# EAGLE design SolarPanel (EAGLE 5.11)
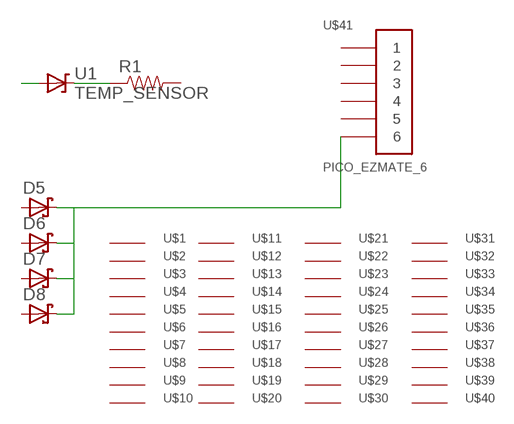
[diagram p0: schematic, sheet 1]

## Parts
D5  SB_DIODE  [SB_DIODE]
D6  SB_DIODE  [SB_DIODE]
D7  SB_DIODE  [SB_DIODE]
D8  SB_DIODE  [SB_DIODE]
R1  RESISTOR  [0805]
U1  TEMP_SENSOR  [SO8]
U$1  PADMI  [PADMI]
U$2  PADMI  [PADMI]
U$3  PADMI  [PADMI]
U$4  PADMI  [PADMI]
U$5  PADMI  [PADMI]
U$6  PADMI  [PADMI]
U$7  PADMI  [PADMI]
U$8  PADMI  [PADMI]
U$9  PADMI  [PADMI]
U$10  PADMI  [PADMI]
U$11  PADMI  [PADMI]
U$12  PADMI  [PADMI]
U$13  PADMI  [PADMI]
U$14  PADMI  [PADMI]
U$15  PADMI  [PADMI]
U$16  PADMI  [PADMI]
U$17  PADMI  [PADMI]
U$18  PADMI  [PADMI]
U$19  PADMI  [PADMI]
U$20  PADMI  [PADMI]
U$21  PADMI  [PADMI]
U$22  PADMI  [PADMI]
U$23  PADMI  [PADMI]
U$24  PADMI  [PADMI]
U$25  PADMI  [PADMI]
U$26  PADMI  [PADMI]
U$27  PADMI  [PADMI]
U$28  PADMI  [PADMI]
U$29  PADMI  [PADMI]
U$30  PADMI  [PADMI]
U$31  PADMI  [PADMI]
U$32  PADMI  [PADMI]
U$33  PADMI  [PADMI]
U$34  PADMI  [PADMI]
U$35  PADMI  [PADMI]
U$36  PADMI  [PADMI]
U$37  PADMI  [PADMI]
U$38  PADMI  [PADMI]
U$39  PADMI  [PADMI]
U$40  PADMI  [PADMI]
U$41  PICO_EZMATE_6  [PICO_EZMATE_6]

## Nets
N$44: D5.NEG D6.NEG D7.NEG D8.NEG U$41.6
N$59: U1.4(V-)
N$60: R1.1 U1.8(V+)
Unconnected: D5.POS D6.POS D7.POS D8.POS R1.2 U$1.P$1 U$2.P$1 U$3.P$1 U$4.P$1 U$5.P$1 U$6.P$1 U$7.P$1 U$8.P$1 U$9.P$1 U$10.P$1 U$11.P$1 U$12.P$1 U$13.P$1 U$14.P$1 U$15.P$1 U$16.P$1 U$17.P$1 U$18.P$1 U$19.P$1 U$20.P$1 U$21.P$1 U$22.P$1 U$23.P$1 U$24.P$1 U$25.P$1 U$26.P$1 U$27.P$1 U$28.P$1 U$29.P$1 U$30.P$1 U$31.P$1 U$32.P$1 U$33.P$1 U$34.P$1 U$35.P$1 U$36.P$1 U$37.P$1 U$38.P$1 U$39.P$1 U$40.P$1 U$41.1 U$41.2 U$41.3 U$41.4 U$41.5

## Library data of the parts
D5-D8 = phonesat:SB_DIODE
R1 = phonesat:RESISTOR: Resistor Basic schematic elements and footprints for 0603, 1206, and PTH 1/10th watt (small) resistors.
U1 = phonesat:TEMP_SENSOR
U$1-U$40 = phonesat:PADMI
U$41 = phonesat:PICO_EZMATE_6

## Board
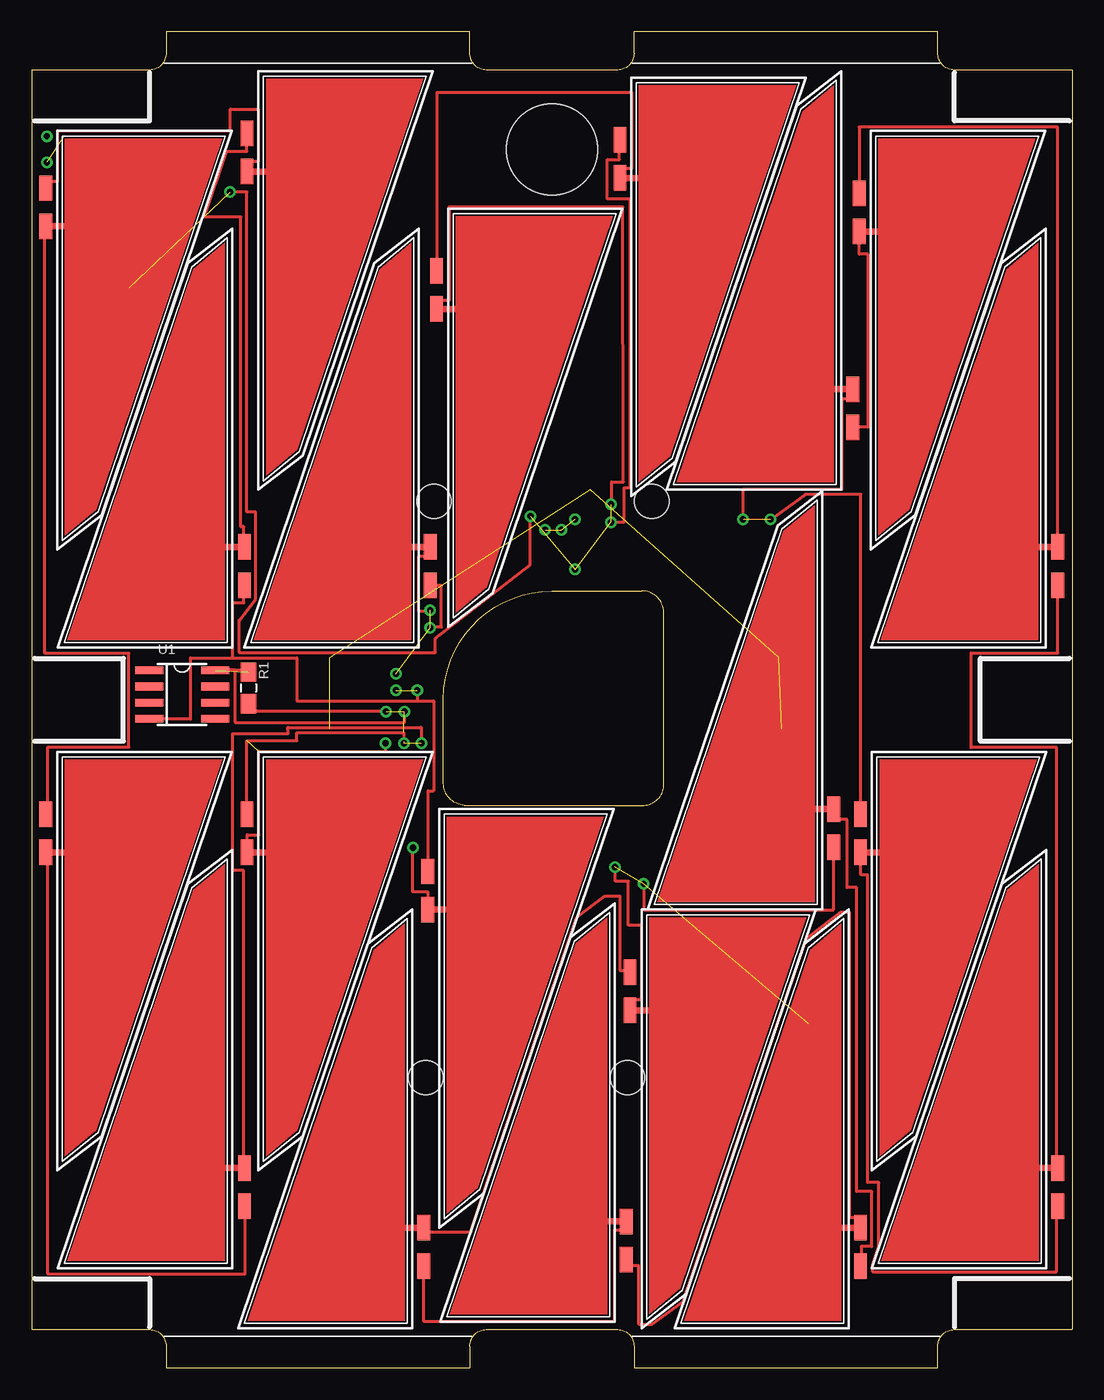
[diagram p1: board, top side]
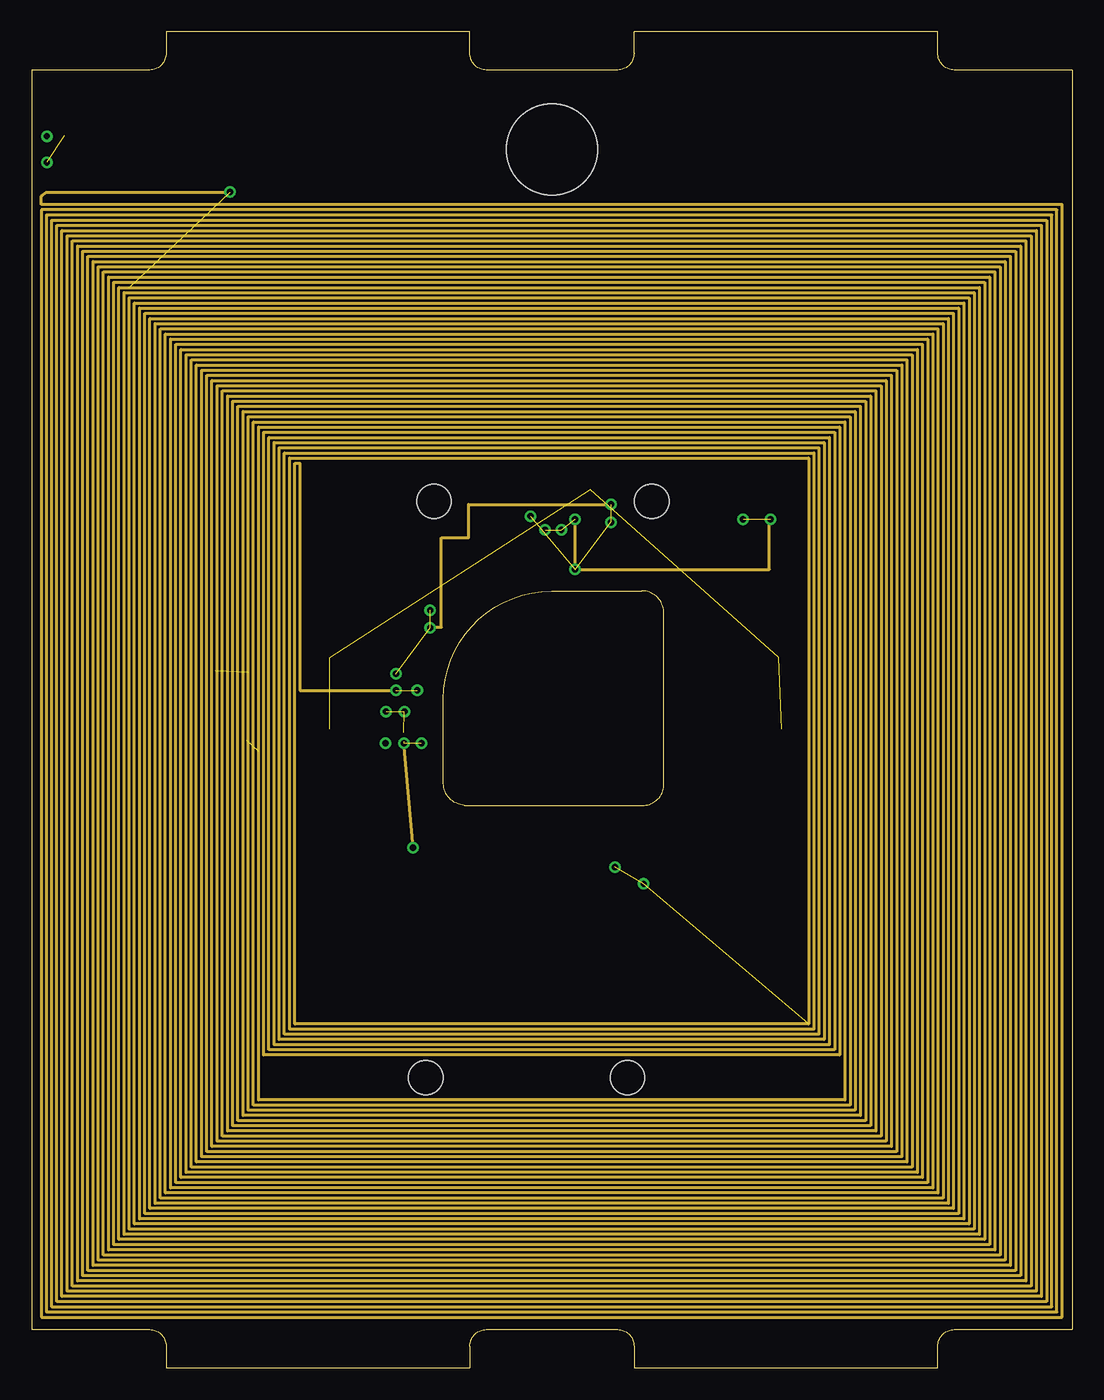
[diagram p2: board, inner layer Route2]
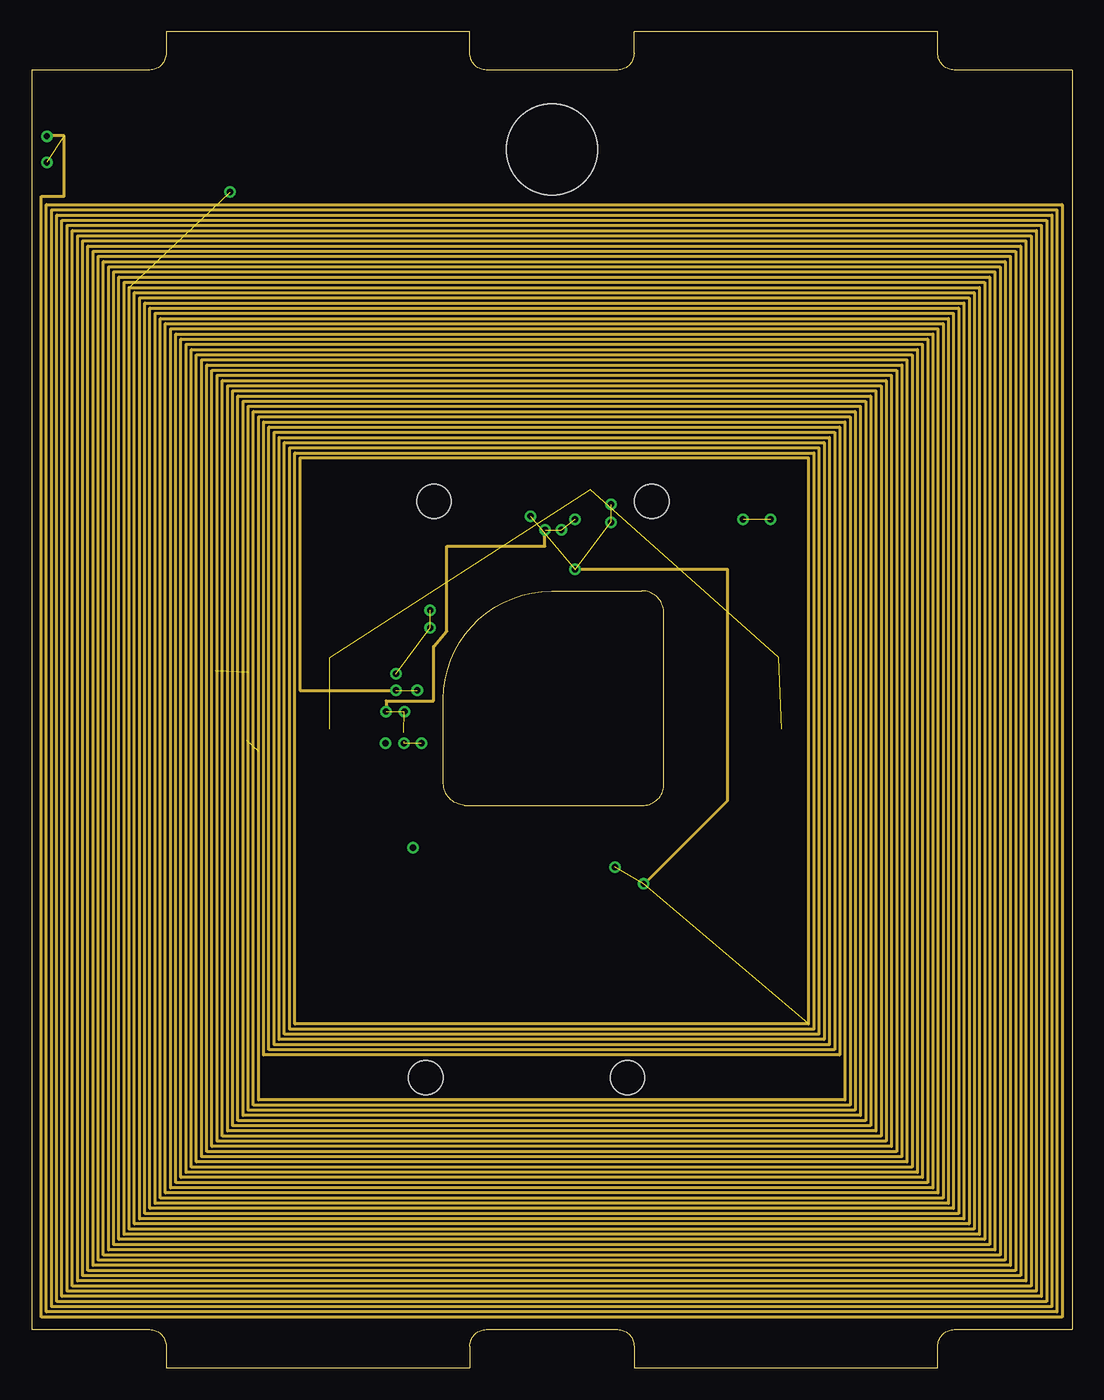
[diagram p3: board, inner layer Route3]
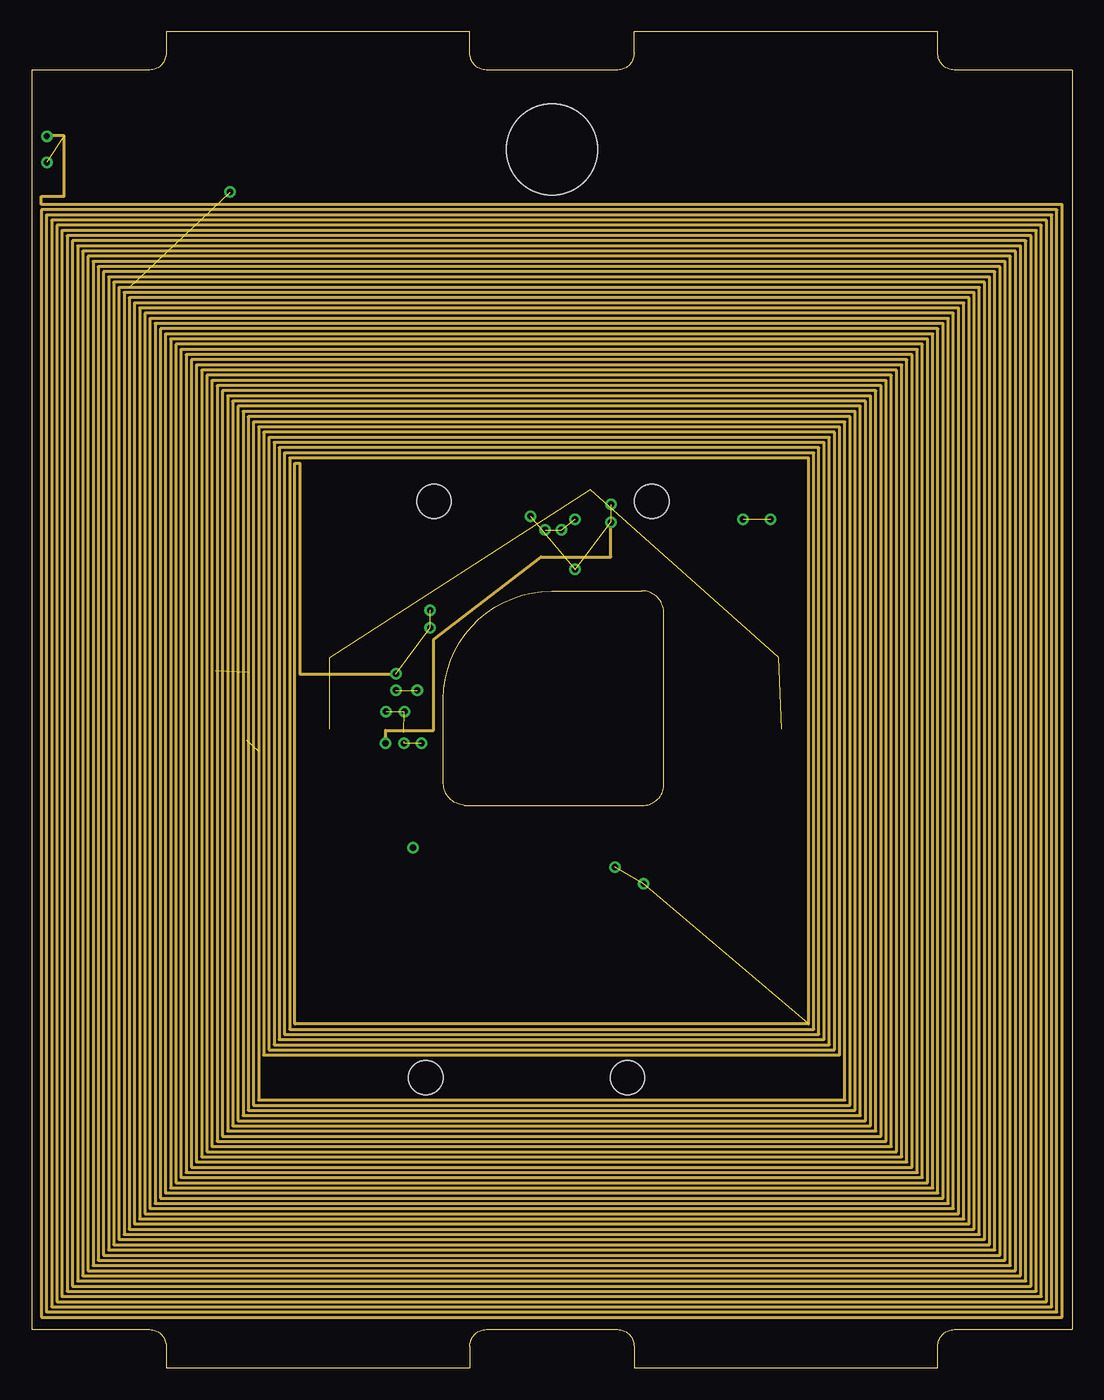
[diagram p4: board, inner layer Route14]
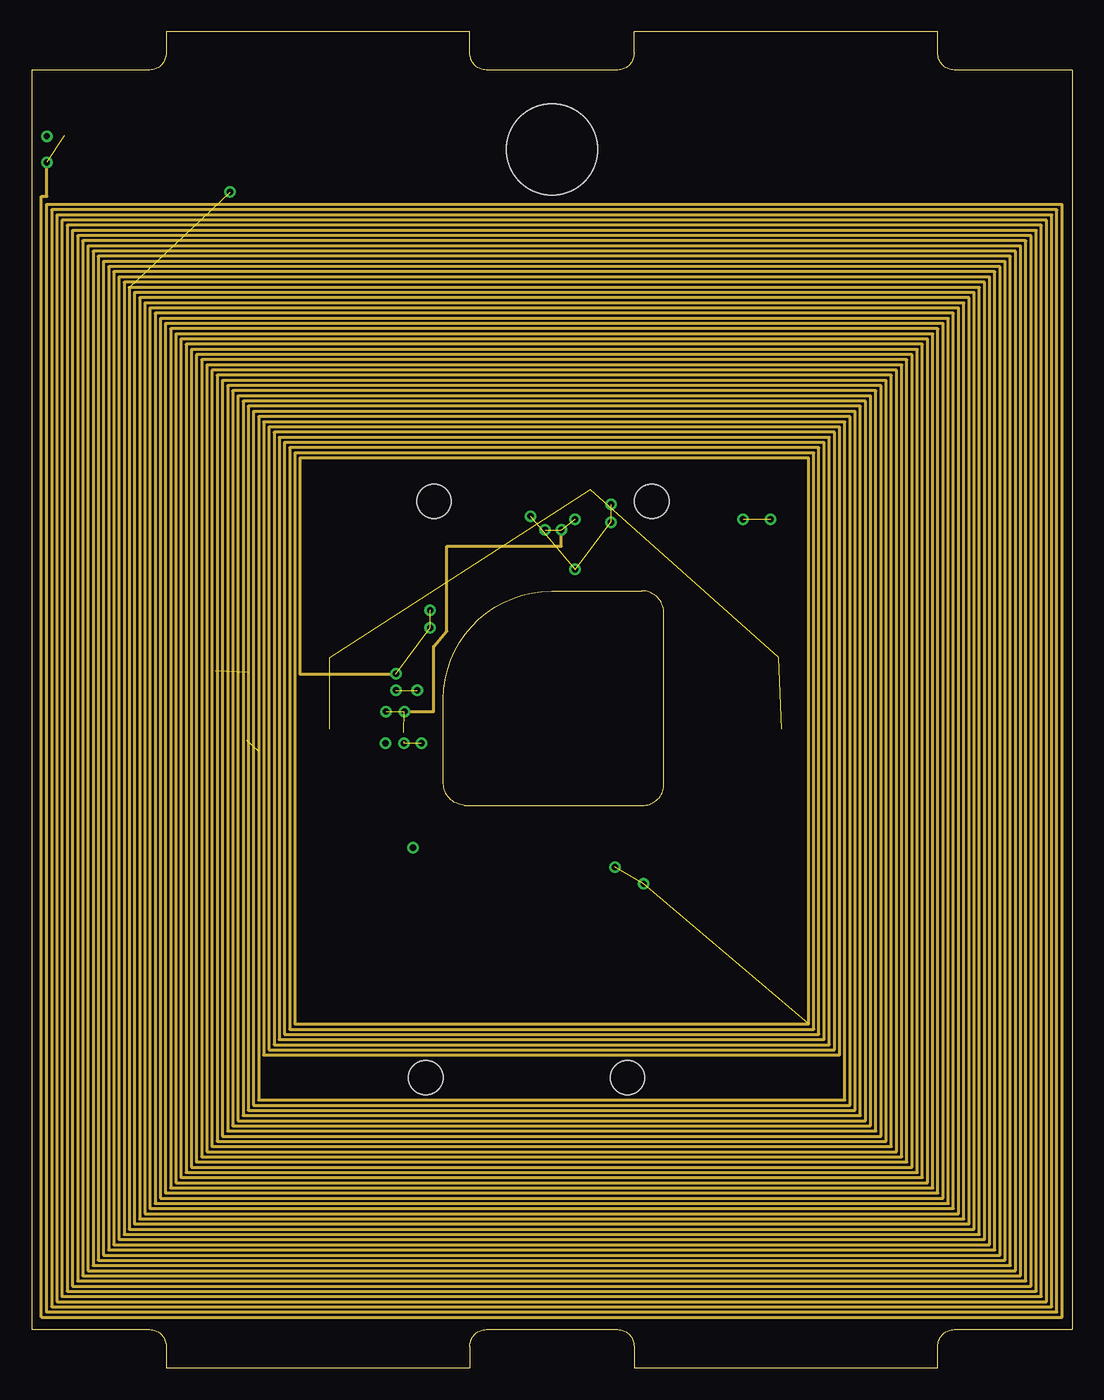
[diagram p5: board, inner layer Route15]
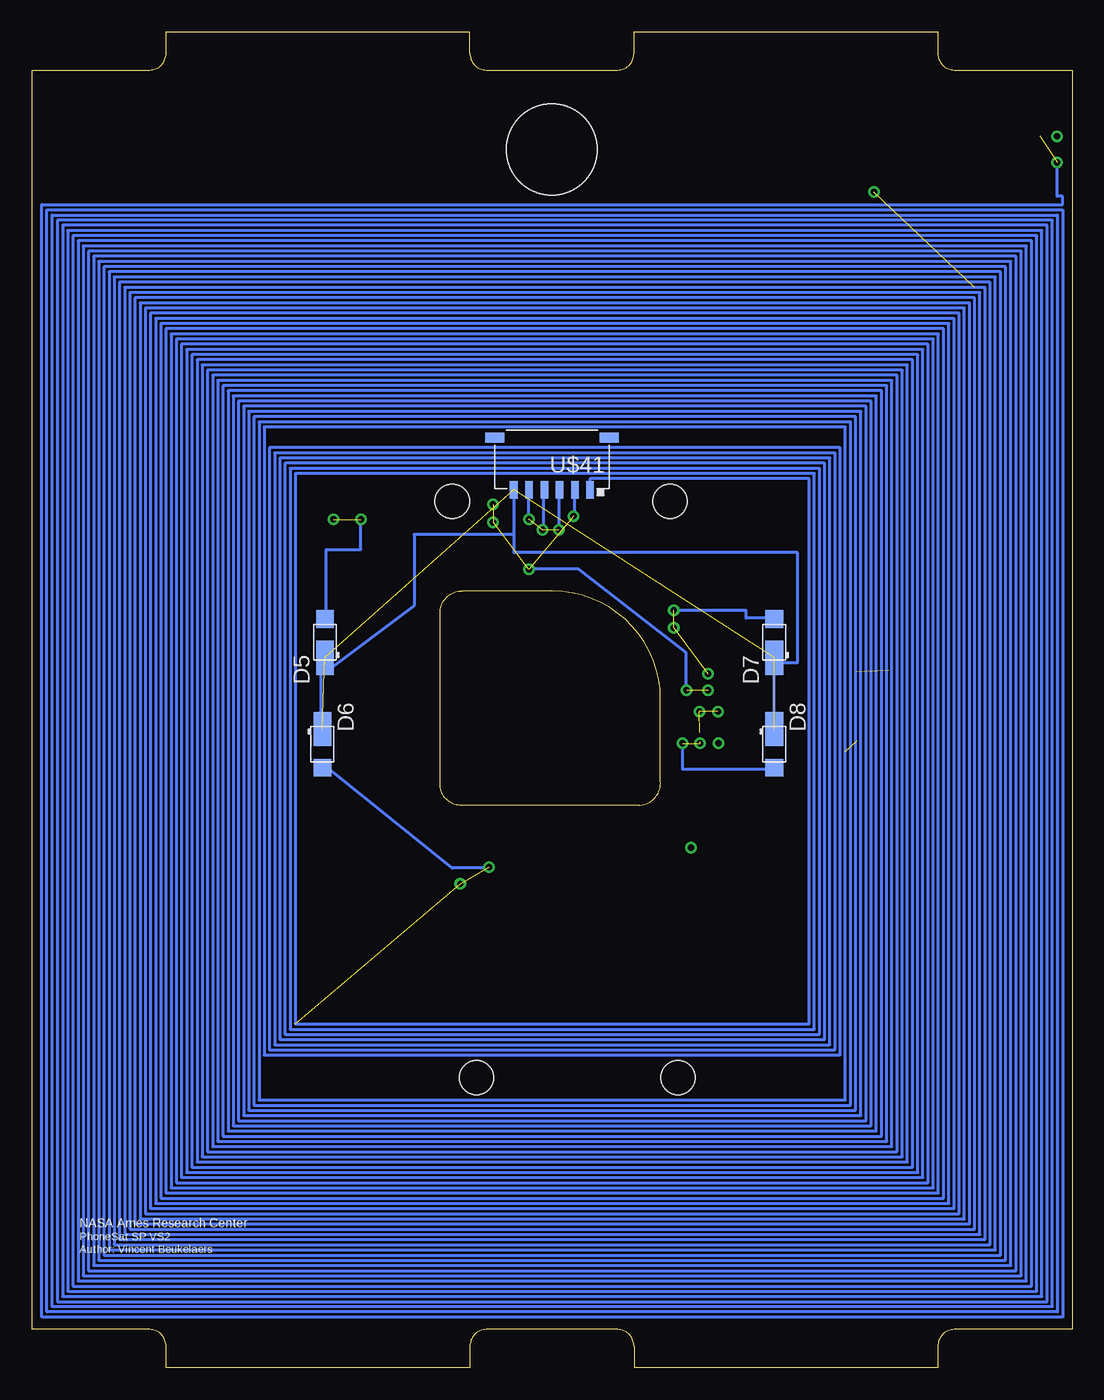
[diagram p6: board, bottom side, seen from below]

Size 81.73 x 104.99 mm. Coordinates in mm from the lower left corner, seen from the top.
Outline: 81.73,101.99 81.73,3 72.48,3 arc90 71.18,1.7 71.18,0 47.31,0 47.31,1.7 arc90 46.02,3 35.72,3 arc90 34.41,1.7 34.41,0 10.55,0 10.55,1.7 arc90 9.25,3 0,3 0,101.99 9.25,101.99 arc90 10.55,103.29 10.55,104.99 34.41,104.99 34.41,103.29 arc90 35.72,101.99 46.02,101.99 arc90 47.31,103.29 47.31,104.99 71.18,104.99 71.18,103.29 arc90 72.48,101.99 81.73,101.99
Outline: 32.34,52.54 arc-90 40.84,61.04 47.91,61.04 arc-90 49.64,59.42 49.65,45.91 arc-90 48.1,44.2 33.96,44.2 arc-90 32.34,46.08 32.34,52.54
Copper layers (1*2*3*14*15*16): Top 0.035mm / dielectric 0.15mm / Route2 0.035mm / dielectric 0.15mm / Route3 0.035mm / dielectric 0.2mm / Route14 0.035mm / dielectric 0.15mm / Route15 0.035mm / dielectric 0.2mm / Bottom 0.035mm
Design rules "default *": minimum track width 10mil, minimum drill 24mil, track to track 8mil, track to pad 8mil, pad to pad 8mil, via to via 8mil, smd to smd 8mil, copper to edge 40mil, drill to drill 8mil, minimum pad ring 10mil, minimum via ring 8mil, stop-mask expansion 4mil, vias tented up to drill 0mil, thermal gap 10mil
Holes 7.14 mm at 40.87,95.74
Holes 2.7 mm at 31.6,68.1 48.7,68.1 46.8,22.8 30.95,22.8

### Footprints (pad centres in the part's own frame; a part is rotated, then mirrored left to right if it is on the bottom)
SB_DIODE = smd 2.7 x 1.4: NEG -1.2,0 | smd 1.4 x 1.4: POS 1.85,0
0805 = smd 1.5 x 1.2: 1 -1.25,0; 2 1.25,0
SO8 = smd 0.6 x 2.2: 1 -1.905,-2.6; 2 -0.635,-2.6; 3 0.635,-2.6; 4 1.905,-2.6; 5 1.905,2.6; 6 0.635,2.6; 7 -0.635,2.6; 8 -1.905,2.6
PADMI = smd 2 x 1: P$1 0,0
PICO_EZMATE_6 = smd 0.6 x 1.4: 1 -3,0.3; 2 -1.8,0.3; 3 -0.6,0.3; 4 0.6,0.3; 5 1.8,0.3; 6 3,0.3 | smd 1.5 x 0.8: ANCHOR$1 -4.5,-3.8; ANCHOR$2 4.5,-3.8

### Placement (x,y rotation side)
D5  58.7,57 90 bottom
D6  58.9,49 270 bottom
D7  23.4,57 90 bottom
D8  23.4,49 270 bottom
R1  17.02,53.43 270 top
U1  11.81,52.9 270 top
U$1  1.1,40.5 90 top
U$2  16.7,15.7 90 top
U$3  30.8,8 90 top
U$4  16.9,40.5 90 top
U$5  16.9,43.5 90 top
U$6  16.7,12.7 90 top
U$7  46.7,11.5 90 top
U$8  46.7,8.5 90 top
U$9  31.1,39 90 top
U$10  31.1,36 90 top
U$11  47,31.1 90 top
U$12  30.8,11 90 top
U$13  80.6,15.7 90 top
U$14  80.6,12.7 90 top
U$15  65.1,8 90 top
U$16  47,28.1 90 top
U$17  65.1,11 90 top
U$18  65.1,43.5 90 top
U$19  1.1,89.7 90 top
U$20  1.1,92.7 90 top
U$21  16.7,61.5 90 top
U$22  16.7,64.5 90 top
U$23  16.9,97 90 top
U$24  65.1,40.5 90 top
U$25  31.3,61.5 90 top
U$26  31.3,64.5 90 top
U$27  31.8,86.2 90 top
U$28  31.8,83.2 90 top
U$29  46.2,93.5 90 top
U$30  46.2,96.5 90 top
U$31  64.5,73.9 90 top
U$32  64.5,76.9 90 top
U$33  80.6,61.5 90 top
U$34  80.6,64.5 90 top
U$35  65,92.3 90 top
U$36  65,89.3 90 top
U$37  16.9,94 90 top
U$38  63,40.9 90 top
U$39  63,43.9 90 top
U$40  1.1,43.5 90 top
U$41  40.87,69.3 180 bottom

### Tracks (layer width: path | path; a pad name or v marks a point on that pad's centre or on a via)
N$1
  Bottom 0.254: 37.87,69.86 20.66,69.86 20.66,27.01 61.03,27.01 61.03,70.27 20.25,70.27 20.25,26.61 61.44,26.61 61.44,70.68 19.84,70.68 19.84,26.2 61.84,26.2 61.84,71.08 19.44,71.08 19.44,25.79 62.25,25.79 62.25,71.49 19.03,71.49 19.03,25.39 62.66,25.39 62.66,71.9 18.63,71.9 18.63,24.98 63.06,24.98 63.06,72.3 18.22,72.3 18.22,24.57 63.47,24.57 63.47,73.93 17.81,73.93 17.81,21.04 63.88,21.04 63.88,74.34 17.41,74.34 17.41,20.64 64.28,20.64 64.28,74.74 17,74.74 17,20.23 64.69,20.23 64.69,75.15 16.59,75.15 16.59,19.82 65.09,19.82 65.09,75.56 16.19,75.56 16.19,19.42 65.5,19.42 65.5,75.96 15.78,75.96 15.78,19.01 65.91,19.01 65.91,76.37 15.38,76.37 15.38,18.61 66.31,18.61 66.31,76.77 14.97,76.77 14.97,18.2 66.72,18.2 66.72,77.18 14.56,77.18 14.56,17.79 67.13,17.79 67.13,77.59 14.16,77.59 14.16,17.39 67.53,17.39 67.53,77.99 13.75,77.99 13.75,16.98 67.94,16.98 67.94,78.4 13.34,78.4 13.34,16.57 68.35,16.57 68.35,78.81 12.94,78.81 12.94,16.17 68.75,16.17 68.75,79.21 12.53,79.21 12.53,15.76 69.16,15.76 69.16,79.62 12.12,79.62 12.12,15.35 69.57,15.35 69.57,80.03 11.72,80.03 11.72,14.95 69.97,14.95 69.97,80.43 11.31,80.43 11.31,14.54 70.38,14.54 70.38,80.84 10.9,80.84 10.9,14.13 70.78,14.13 70.78,81.24 10.5,81.24 10.5,13.73 71.19,13.73 71.19,81.65 10.09,81.65 10.09,13.32 71.6,13.32 71.6,82.06 9.69,82.06 9.69,12.91 72,12.91 72,82.46 9.28,82.46 9.28,12.51 72.41,12.51 72.41,82.87 8.87,82.87 8.87,12.1 72.82,12.1 72.82,83.28 8.47,83.28 8.47,11.7 73.22,11.7 73.22,83.68 8.06,83.68 8.06,11.29 73.63,11.29 73.63,84.09 7.65,84.09 7.65,10.88 74.04,10.88 74.04,84.5 7.25,84.5 7.25,10.48 74.44,10.48 74.44,84.9 6.84,84.9 6.84,10.07 74.85,10.07 74.85,85.31 6.43,85.31 6.43,9.66 75.25,9.66 75.25,85.72 6.03,85.72 6.03,9.26 75.66,9.26 75.66,86.12 5.62,86.12 5.62,8.85 76.07,8.85 76.07,86.53 5.21,86.53 5.21,8.45 76.47,8.45 76.47,86.93 4.81,86.93 4.81,8.04 76.88,8.04 76.88,87.34 4.4,87.34 4.4,7.63 77.29,7.63 77.29,87.75 4,87.75 4,7.23 77.69,7.23 77.69,88.15 3.59,88.15 3.59,6.82 78.1,6.82 78.1,88.56 3.18,88.56 3.18,6.41 78.51,6.41 78.51,88.97 2.78,88.97 2.78,6.01 78.91,6.01 78.91,89.37 2.37,89.37 2.37,5.6 79.32,5.6 79.32,89.78 1.96,89.78 1.96,5.19 79.73,5.19 79.73,90.19 1.56,90.19 1.56,4.79 80.13,4.79 80.13,90.59 1.15,90.59 1.15,4.38 80.54,4.38 80.54,91 0.74,91 0.74,3.97 80.94,3.97 80.94,91.4 0.74,91.4 0.74,92.06 1.18,92.06 1.18,94.8
N$2
  Top 0.5: 1.4,89.7 2.9,89.7
N$3
  Route15 0.254: 1.18,94.8 1.18,92.06 0.74,92.06 0.74,3.97 80.94,3.97 80.94,91.4 1.15,91.4 1.15,4.38 80.54,4.38 80.54,91 1.56,91 1.56,4.79 80.13,4.79 80.13,90.59 1.96,90.59 1.96,5.19 79.73,5.19 79.73,90.19 2.37,90.19 2.37,5.6 79.32,5.6 79.32,89.78 2.78,89.78 2.78,6.01 78.91,6.01 78.91,89.37 3.18,89.37 3.18,6.41 78.51,6.41 78.51,88.97 3.59,88.97 3.59,6.82 78.1,6.82 78.1,88.56 4,88.56 4,7.23 77.69,7.23 77.69,88.15 4.4,88.15 4.4,7.63 77.29,7.63 77.29,87.75 4.81,87.75 4.81,8.04 76.88,8.04 76.88,87.34 5.21,87.34 5.21,8.45 76.47,8.45 76.47,86.93 5.62,86.93 5.62,8.85 76.07,8.85 76.07,86.53 6.03,86.53 6.03,9.26 75.66,9.26 75.66,86.12 6.43,86.12 6.43,9.66 75.25,9.66 75.25,85.72 6.84,85.72 6.84,10.07 74.85,10.07 74.85,85.31 7.25,85.31 7.25,10.48 74.44,10.48 74.44,84.9 7.65,84.9 7.65,10.88 74.04,10.88 74.04,84.5 8.06,84.5 8.06,11.29 73.63,11.29 73.63,84.09 8.47,84.09 8.47,11.7 73.22,11.7 73.22,83.68 8.87,83.68 8.87,12.1 72.82,12.1 72.82,83.28 9.28,83.28 9.28,12.51 72.41,12.51 72.41,82.87 9.69,82.87 9.69,12.91 72,12.91 72,82.46 10.09,82.46 10.09,13.32 71.6,13.32 71.6,82.06 10.5,82.06 10.5,13.73 71.19,13.73 71.19,81.65 10.9,81.65 10.9,14.13 70.78,14.13 70.78,81.24 11.31,81.24 11.31,14.54 70.38,14.54 70.38,80.84 11.72,80.84 11.72,14.95 69.97,14.95 69.97,80.43 12.12,80.43 12.12,15.35 69.57,15.35 69.57,80.03 12.53,80.03 12.53,15.76 69.16,15.76 69.16,79.62 12.94,79.62 12.94,16.17 68.75,16.17 68.75,79.21 13.34,79.21 13.34,16.57 68.35,16.57 68.35,78.81 13.75,78.81 13.75,16.98 67.94,16.98 67.94,78.4 14.16,78.4 14.16,17.39 67.53,17.39 67.53,77.99 14.56,77.99 14.56,17.79 67.13,17.79 67.13,77.59 14.97,77.59 14.97,18.2 66.72,18.2 66.72,77.18 15.38,77.18 15.38,18.61 66.31,18.61 66.31,76.77 15.78,76.77 15.78,19.01 65.91,19.01 65.91,76.37 16.19,76.37 16.19,19.42 65.5,19.42 65.5,75.96 16.59,75.96 16.59,19.82 65.09,19.82 65.09,75.56 17,75.56 17,20.23 64.69,20.23 64.69,75.15 17.41,75.15 17.41,20.64 64.28,20.64 64.28,74.74 17.81,74.74 17.81,21.04 63.88,21.04 63.88,74.34 18.22,74.34 18.22,24.57 63.47,24.57 63.47,73.93 18.63,73.93 18.63,24.98 63.06,24.98 63.06,73.52 19.03,73.52 19.03,25.39 62.66,25.39 62.66,73.12 19.44,73.12 19.44,25.79 62.25,25.79 62.25,72.71 19.84,72.71 19.84,26.2 61.84,26.2 61.84,72.3 20.25,72.3 20.25,26.61 61.44,26.61 61.44,71.9 20.66,71.9 20.66,27.01 61.03,27.01 61.03,71.49 21.06,71.49 21.06,54.51 28.58,54.51
N$4
  Bottom 0.254: 37.87,69.39 37.87,69.85
N$5
  Top 0.5: 17.1,94 18.5,94
N$6
  Top 0.5: 15,64.5 16.4,64.5
N$7
  Top 0.5: 29.6,64.5 31,64.5
N$8
  Top 0.254: 80.62,60.88 80.62,56.19 73.79,56.19 73.79,48.74 80.52,48.74 80.52,16.38
N$9
  Top 0.5: 32.2,83.2 33.5,83.2
N$10
  Top 0.5: 48.1,93.5 46.5,93.5
N$11
  Top 0.5: 62.8,76.9 64.2,76.9
N$12
  Top 0.5: 78.9,64.5 80.3,64.5
N$13
  Top 0.5: 65.3,89.3 66.6,89.3
N$14
  Top 0.5: 1.4,40.5 3,40.5
N$15
  Top 0.5: 17.2,40.5 18.6,40.5
N$16
  Top 0.5: 14.8,15.7 16.5,15.7
N$17
  Top 0.5: 29.1,11 30.6,11
N$18
  Top 0.5: 44.8,11.5 46.4,11.5
N$19
  Top 0.5: 63.2,11 64.9,11
N$20
  Top 0.5: 78.6,15.7 80.2,15.7
N$21
  Top 0.5: 32.7,36 31.5,36
N$22
  Top 0.5: 47.3,28.1 48.7,28.1
N$23
  Top 0.5: 61.2,43.9 62.7,43.9
N$24
  Top 0.5: 65.4,40.5 67.2,40.5
N$25
  Top 0.254: 1.02,89.15 1.02,56.13 7.62,56.13 7.62,48.77 1.27,48.77 1.27,43.94
N$26
  Top 0.254: 1.27,39.88 1.27,7.37 16.76,7.37 16.76,12.19
N$27
  Route3 0.254: 2.54,96.83 1.17,96.83
N$28
  Route14 0.254: 2.54,96.83 1.17,96.83
N$29
  Top 0.254: 31.85,86.79 31.85,100.23 47.14,100.23 47.14,94.23 46.41,94.23
N$30
  Top 0.254: 32.13,83.87 32.79,83.87 32.79,91.21 46.43,91.21 46.48,69.62 45.54,69.62 45.54,68.07
N$31
  Top 0.254: 16.64,16.33 16.64,39.06 15.77,39.06 15.77,49.84 20.14,49.84 20.12,50.32 30.58,50.32 30.61,49.07
N$32
  Top 0.254: 46.46,10.85 45.8,10.85 45.8,3.63 30.81,3.63 30.81,7.34
N$33  (via drill 0.5)  (2 unrouted)
  other vias: 42.68,66.68 41.6,65.84 40.33,65.84
N$34
  Top 0.254: 1.27,93.22 2.03,93.22 2.03,97.23 15.6,97.23 15.6,98.91 17.78,98.91 17.78,94.77 16.97,94.77
N$35
  Top 0.254: 64.8,73.91 65.71,73.91 65.71,87.5 65.02,87.5 65.02,88.72
N$36
  Top 0.254: 65,92.99 65,97.51 80.59,97.51 80.59,65.02
N$37
  Top 0.254: 31.09,10.67 34.49,10.67 42.82,35.38 45.06,37.06 46.2,37.06 46.2,31.24 46.74,31.24
N$38
  Bottom 0.254: 30.61,49.1 30.61,47.02 23.44,47.02
N$39  (via drill 0.5)  (8 unrouted)
  Route2 0.254: v28.61,53.24 21.06,53.24 21.06,71.08 20.66,71.08 20.66,27.01 61.03,27.01 61.03,71.49 20.25,71.49 20.25,26.61 61.44,26.61 61.44,71.9 19.84,71.9 19.84,26.2 61.84,26.2 61.84,72.3 19.44,72.3 19.44,25.79 62.25,25.79 62.25,72.71 19.03,72.71 19.03,25.39 62.66,25.39 62.66,73.12 18.63,73.11 18.63,24.98 63.06,24.98 63.06,73.52 18.22,73.52 18.22,24.57 63.47,24.57 63.47,73.93 17.81,73.93 17.81,21.04 63.88,21.04 63.88,74.34 17.41,74.34 17.41,20.64 64.28,20.64 64.28,74.74 17,74.74 17,20.23 64.69,20.23 64.69,75.15 16.59,75.15 16.59,19.82 65.09,19.82 65.09,75.56 16.19,75.56 16.19,19.42 65.5,19.42 65.5,75.96 15.78,75.96 15.78,19.01 65.91,19.01 65.91,76.37 15.38,76.37 15.38,18.61 66.31,18.61 66.31,76.77 14.97,76.77 14.97,18.2 66.72,18.2 66.72,77.18 14.56,77.18 14.56,17.79 67.13,17.79 67.13,77.59 14.16,77.59 14.16,17.39 67.53,17.39 67.53,77.99 13.75,77.99 13.75,16.98 67.94,16.98 67.94,78.4 13.34,78.4 13.34,16.57 68.35,16.57 68.35,78.81 12.94,78.81 12.94,16.17 68.75,16.17 68.75,79.21 12.53,79.21 12.53,15.76 69.16,15.76 69.16,79.62 12.12,79.62 12.12,15.35 69.57,15.35 69.57,80.03 11.72,80.03 11.72,14.95 69.97,14.95 69.97,80.43 11.31,80.43 11.31,14.54 70.38,14.54 70.38,80.84 10.9,80.84 10.9,14.13 70.78,14.13 70.78,81.24 10.5,81.24 10.5,13.73 71.19,13.73 71.19,81.65 10.09,81.65 10.09,13.32 71.6,13.32 71.6,82.06 9.69,82.06 9.69,12.91 72,12.91 72,82.46 9.28,82.46 9.28,12.51 72.41,12.51 72.41,82.87 8.87,82.87 8.87,12.1 72.82,12.1 72.82,83.28 8.47,83.28 8.47,11.7 73.22,11.7 73.22,83.68 8.06,83.68 8.06,11.29 73.63,11.29 73.63,84.09 7.65,84.09 7.65,10.88 74.04,10.88 74.04,84.5 7.25,84.5 7.25,10.48 74.44,10.48 74.44,84.9 6.84,84.9 6.84,10.07 74.85,10.07 74.85,85.31 6.43,85.31 6.43,9.66 75.25,9.66 75.25,85.72 6.03,85.72 6.03,9.26 75.66,9.26 75.66,86.12 5.62,86.12 5.62,8.85 76.07,8.85 76.07,86.53 5.21,86.53 5.21,8.45 76.47,8.45 76.47,86.93 4.81,86.93 4.81,8.04 76.88,8.04 76.88,87.34 4.4,87.34 4.4,7.63 77.29,7.63 77.29,87.75 4,87.75 4,7.23 77.69,7.23 77.69,88.15 3.59,88.15 3.59,6.82 78.1,6.82 78.1,88.56 3.18,88.56 3.18,6.41 78.51,6.41 78.51,88.97 2.78,88.97 2.78,6.01 78.91,6.01 78.91,89.37 2.37,89.37 2.37,5.6 79.32,5.6 79.32,89.78 1.96,89.78 1.96,5.19 79.73,5.19 79.73,90.19 1.56,90.19 1.56,4.79 80.13,4.79 80.13,90.59 1.15,90.59 1.15,4.38 80.54,4.38 80.54,91 0.74,91 0.74,3.97 80.94,3.97 80.94,91.4 0.74,91.4 0.74,92.06 1.17,92.37 15.55,92.37
  Route3 0.254: 2.54,96.82 2.54,92.06 0.74,92.06 0.74,3.97 80.94,3.97 80.94,91.4 1.15,91.4 1.15,4.38 80.54,4.38 80.54,91 1.56,91 1.56,4.79 80.13,4.79 80.13,90.59 1.96,90.59 1.96,5.19 79.73,5.19 79.73,90.19 2.37,90.19 2.37,5.6 79.32,5.6 79.32,89.78 2.78,89.78 2.78,6.01 78.91,6.01 78.91,89.37 3.18,89.37 3.18,6.41 78.51,6.41 78.51,88.97 3.59,88.97 3.59,6.82 78.1,6.82 78.1,88.56 4,88.56 4,7.23 77.69,7.23 77.69,88.15 4.4,88.15 4.4,7.63 77.29,7.63 77.29,87.75 4.81,87.75 4.81,8.04 76.88,8.04 76.88,87.34 5.21,87.34 5.21,8.45 76.47,8.45 76.47,86.93 5.62,86.93 5.62,8.85 76.07,8.85 76.07,86.53 6.03,86.53 6.03,9.26 75.66,9.26 75.66,86.12 6.43,86.12 6.43,9.66 75.25,9.66 75.25,85.72 6.84,85.72 6.84,10.07 74.85,10.07 74.85,85.31 7.25,85.31 7.25,10.48 74.44,10.48 74.44,84.9 7.65,84.9 7.65,10.88 74.04,10.88 74.04,84.5 8.06,84.5 8.06,11.29 73.63,11.29 73.63,84.09 8.47,84.09 8.47,11.7 73.22,11.7 73.22,83.68 8.87,83.68 8.87,12.1 72.82,12.1 72.82,83.28 9.28,83.28 9.28,12.51 72.41,12.51 72.41,82.87 9.69,82.87 9.69,12.91 72,12.91 72,82.46 10.09,82.46 10.09,13.32 71.6,13.32 71.6,82.06 10.5,82.06 10.5,13.73 71.19,13.73 71.19,81.65 10.9,81.65 10.9,14.13 70.78,14.13 70.78,81.24 11.31,81.24 11.31,14.54 70.38,14.54 70.38,80.84 11.72,80.84 11.72,14.95 69.97,14.95 69.97,80.43 12.12,80.43 12.12,15.35 69.57,15.35 69.57,80.03 12.53,80.03 12.53,15.76 69.16,15.76 69.16,79.62 12.94,79.62 12.94,16.17 68.75,16.17 68.75,79.21 13.34,79.21 13.34,16.57 68.35,16.57 68.35,78.81 13.75,78.81 13.75,16.98 67.94,16.98 67.94,78.4 14.16,78.4 14.16,17.39 67.53,17.39 67.53,77.99 14.56,77.99 14.56,17.79 67.13,17.79 67.13,77.59 14.97,77.59 14.97,18.2 66.72,18.2 66.72,77.18 15.38,77.18 15.38,18.61 66.31,18.61 66.31,76.77 15.78,76.77 15.78,19.01 65.91,19.01 65.91,76.37 16.19,76.37 16.19,19.42 65.5,19.42 65.5,75.96 16.59,75.96 16.59,19.82 65.09,19.82 65.09,75.56 17,75.56 17,20.23 64.69,20.23 64.69,75.15 17.41,75.15 17.41,20.64 64.28,20.64 64.28,74.74 17.81,74.74 17.81,21.04 63.88,21.04 63.88,74.34 18.22,74.34 18.22,24.57 63.47,24.57 63.47,73.93 18.63,73.93 18.63,24.98 63.06,24.98 63.06,73.52 19.03,73.52 19.03,25.39 62.66,25.39 62.66,73.12 19.44,73.12 19.44,25.79 62.25,25.79 62.25,72.71 19.84,72.71 19.84,26.2 61.84,26.2 61.84,72.3 20.25,72.3 20.25,26.61 61.44,26.61 61.44,71.9 20.66,71.9 20.66,27.01 61.03,27.01 61.03,71.49 21.06,71.49 21.06,53.24 v28.61,53.24
  Route14 0.254: 2.54,96.82 2.54,92.06 0.74,92.06 0.74,91.4 80.94,91.4 80.94,3.97 0.74,3.97 0.74,91 80.54,91 80.54,4.38 1.15,4.38 1.15,90.59 80.13,90.59 80.13,4.79 1.56,4.79 1.56,90.19 79.73,90.19 79.73,5.19 1.96,5.19 1.96,89.78 79.32,89.78 79.32,5.6 2.37,5.6 2.37,89.37 78.91,89.37 78.91,6.01 2.78,6.01 2.78,88.97 78.51,88.97 78.51,6.41 3.18,6.41 3.18,88.56 78.1,88.56 78.1,6.82 3.59,6.82 3.59,88.15 77.69,88.15 77.69,7.23 4,7.23 4,87.75 77.29,87.75 77.29,7.63 4.4,7.63 4.4,87.34 76.88,87.34 76.88,8.04 4.81,8.04 4.81,86.93 76.47,86.93 76.47,8.45 5.21,8.45 5.21,86.53 76.07,86.53 76.07,8.85 5.62,8.85 5.62,86.12 75.66,86.12 75.66,9.26 6.03,9.26 6.03,85.72 75.25,85.72 75.25,9.66 6.43,9.66 6.43,85.31 74.85,85.31 74.85,10.07 6.84,10.07 6.84,84.9 74.44,84.9 74.44,10.48 7.25,10.48 7.25,84.5 74.04,84.5 74.04,10.88 7.65,10.88 7.65,84.09 73.63,84.09 73.63,11.29 8.06,11.29 8.06,83.68 73.22,83.68 73.22,11.7 8.47,11.7 8.47,83.28 72.82,83.28 72.82,12.1 8.87,12.1 8.87,82.87 72.41,82.87 72.41,12.51 9.28,12.51 9.28,82.46 72,82.46 72,12.91 9.69,12.91 9.69,82.06 71.6,82.06 71.6,13.32 10.09,13.32 10.09,81.65 71.19,81.65 71.19,13.73 10.5,13.73 10.5,81.24 70.78,81.24 70.78,14.13 10.9,14.13 10.9,80.84 70.38,80.84 70.38,14.54 11.31,14.54 11.31,80.43 69.97,80.43 69.97,14.95 11.72,14.95 11.72,80.03 69.57,80.03 69.57,15.35 12.12,15.35 12.12,79.62 69.16,79.62 69.16,15.76 12.53,15.76 12.53,79.21 68.75,79.21 68.75,16.17 12.94,16.17 12.94,78.81 68.35,78.81 68.35,16.57 13.34,16.57 13.34,78.4 67.94,78.4 67.94,16.98 13.75,16.98 13.75,77.99 67.53,77.99 67.53,17.39 14.16,17.39 14.16,77.59 67.13,77.59 67.13,17.79 14.56,17.79 14.56,77.18 66.72,77.18 66.72,18.2 14.97,18.2 14.97,76.77 66.31,76.77 66.31,18.61 15.38,18.61 15.38,76.37 65.91,76.37 65.91,19.01 15.78,19.01 15.78,75.96 65.5,75.96 65.5,19.42 16.19,19.42 16.19,75.56 65.09,75.56 65.09,19.82 16.59,19.82 16.59,75.15 64.69,75.15 64.69,20.23 17,20.23 17,74.74 64.28,74.74 64.28,20.64 17.41,20.64 17.41,74.34 63.88,74.34 63.88,21.04 17.81,21.04 17.81,73.93 63.47,73.93 63.47,24.57 18.22,24.57 18.22,73.52 63.06,73.52 63.06,24.98 18.63,24.98 18.63,73.12 62.66,73.12 62.66,25.39 19.03,25.39 19.03,72.71 62.25,72.71 62.25,25.79 19.44,25.79 19.44,72.3 61.84,72.3 61.84,26.2 19.84,26.2 19.84,71.9 61.44,71.9 61.44,26.61 20.25,26.61 20.25,71.49 61.03,71.49 61.03,27.01 20.66,27.01 20.66,71.08 21.06,71.08 21.06,54.51 28.61,54.51
  other vias: 1.17,94.72 15.57,92.4 31.3,59.54 31.3,58.17 28.61,54.53 30.28,53.24 45.81,39.34 48.07,38.02 1.17,96.78
N$40
  Bottom 0.254: 55.88,66.6 55.88,64.31 58.6,64.31 58.6,59.05
N$41
  Top 0.254: 47.22,28.91 47.9,28.91 47.9,34.77 46.86,34.77 46.86,38.23 45.85,38.23 45.85,39.29
N$42
  Top 0.254: 65,11.81 64.24,11.81 64.24,35.81 63.6,35.81 60.83,33.68 51.18,5.18 48.74,3.43 47.68,3.43 47.68,8.03 46.81,8.03
N$43
  Top 0.254: 46.15,95.76 46.15,94.94 45.21,94.94 45.21,91.85 47.02,91.85 47.02,69.16 46.53,69.16 46.53,66.45 45.49,66.45
N$44  (4 unrouted)
N$45
  Bottom 0.254: 45.85,39.27 48.69,39.27 58.37,47.04
N$47
  Top 0.254: 29.92,40.74 29.92,37.41 31.09,37.41 31.09,36.63 31.11,36.63
N$49
  Top 0.254: 31.14,39.75 31.14,45.34 31.57,45.34
N$50
  Top 0.254: 31.24,63.78 30.4,63.78 30.4,59.49 31.22,59.49 31.22,59.56
N$51
  Top 0.254: 16.89,96.34 16.89,95.61 15.32,95.61 13.56,90.42 16.43,90.42 16.43,66.09 16.66,66.09 16.66,65.33
N$53  (via drill 0.5)  (5 unrouted)
  Top 0.254: 16.89,41.43 16.89,41.88 17.83,41.88 17.83,48.44 27.79,48.44 v27.79,49.07 | 16.89,44.32 16.89,49.28 20.83,49.28 20.83,49.91 29.23,49.91 v29.23,49.07
  Route2 0.254: v29.95,40.86 29.97,40.84 29.23,49.2
  other vias: 27.83,51.57 29.28,51.57 30.61,49.07
N$54
  Route14 0.254: 27.79,49.12 27.79,50.09 31.57,50.09 31.57,57.23 40.01,63.73 45.49,63.73 45.49,66.45
N$55
  Bottom 0.254: 30.33,53.29 30.33,56.21 38.76,62.76 42.77,62.76
N$56
  Bottom 0.254: 42.7,66.67 42.7,68.56
N$57
  Top 0.254: 15.67,92.41 16.89,92.41 16.89,67.26 17.58,67.26 17.58,60.43 16.28,58.73 16.28,56.21 31.7,56.21 31.7,57.3 39.14,63.06 39.14,66.85
N$58
  Bottom 0.254: 39.09,67 39.09,68.4
N$60  (1 unrouted)
N$61
  Top 0.254: 15.98,54.81 15.24,54.81 | 15.98,54.81 17.04,54.81 | 15.98,54.81 15.98,50.72 29.29,50.72 29.29,51.54
N$62
  Top 0.254: 17.16,51.79 17.62,51.61 27.84,51.61
N$63
  Route3 0.254: 27.84,51.59 27.84,52.4 31.57,52.4 31.57,56.69 32.61,57.89 32.61,64.57 40.31,64.57 40.31,65.84
N$64
  Bottom 0.254: 40.31,65.94 40.31,68.45
N$65
  Route15 0.254: 29.29,51.56 31.57,51.56 31.57,56.69 32.61,57.89 32.61,64.57 41.6,64.57 41.6,65.84
N$66
  Bottom 0.254: 41.53,65.94 41.5,65.94 41.5,68.61
N$67
  Route2 0.254: 45.39,67.84 34.31,67.84 34.31,65.23 32.18,65.23 32.18,58.19 31.32,58.19
N$68
  Route2 0.254: 42.67,66.7 42.7,66.65 42.7,62.74 57.94,62.74 57.94,66.6
N$69
  Bottom 0.254: 23.39,50.15 23.39,55.05
N$70
  Top 0.254: 48.11,37.97 48.11,35.99 62.99,35.99 62.99,36.27 62.99,36.3 62.99,40.21
N$71
  Top 0.254: 65.15,8.76 65.15,9.53 65.94,9.53
N$72
  Top 0.254: 65.96,9.53 65.99,9.53 65.99,13.84 64.8,13.84 64.8,37.74 64.06,37.74 64.06,43.08 62.94,43.08
N$73
  Bottom 0.254: 59,50.5 59,54.7
N$74
  Top 0.254: 65.13,39.65 65.13,38.73 65.66,38.73 65.66,14.55 66.55,14.55 66.55,9.47 66.06,8.1 66.06,7.54 80.52,7.54 80.52,12.01
N$75  (via drill 0.5)  (3 unrouted)
  other vias: 39.17,66.93 42.68,62.74 45.5,66.45 45.5,67.84
N$78
  Top 0.254: 10.21,50.98 12.47,50.98 12.47,55.78 15.77,55.78 | 15.77,55.78 15.77,60.12 16.66,60.12 16.66,60.6 | 15.77,55.78 20.83,55.78 20.83,52.4 30.3,52.4 | 30.3,52.4 30.3,53.24 | 31.57,45.34 31.57,52.4 30.3,52.4
N$79
  Top 0.254: 64.39,76.15 63.65,76.15 63.65,69.04 55.88,69.04 55.88,66.93
N$80  (via drill 0.5)  (1 unrouted)
  Top 0.254: v58.04,66.67 60.76,68.63 62.89,68.63 62.99,68.63 65.13,68.63 65.13,44.32
  other vias: 55.88,66.67
N$82
  Route3 0.254: 48.11,38.02 54.66,44.58 54.66,62.74 42.7,62.74
N$83
  Bottom 0.254: 31.19,59.51 25.6,59.51 25.6,58.91 23.66,58.91
N$84
  Top 0.254: 31.32,58.19 32.18,58.19 32.18,61.47 31.65,61.47
N$86
  Bottom 0.254: 23.13,55.4 21.57,55.4 21.57,64.06 43.84,64.06 43.84,65.48 | 58.27,54.93 51.69,59.91 51.69,65.48 43.84,65.48 | 43.84,65.48 43.84,68.58
(copper drawn outside any net)
  shapes: Top area x20

### Text on the board
_bsilk: NASA Ames Research Center | PhoneSat SP VS2 | Author: Vincent Beukelaers